# EAGLE design display (EAGLE 5.11)
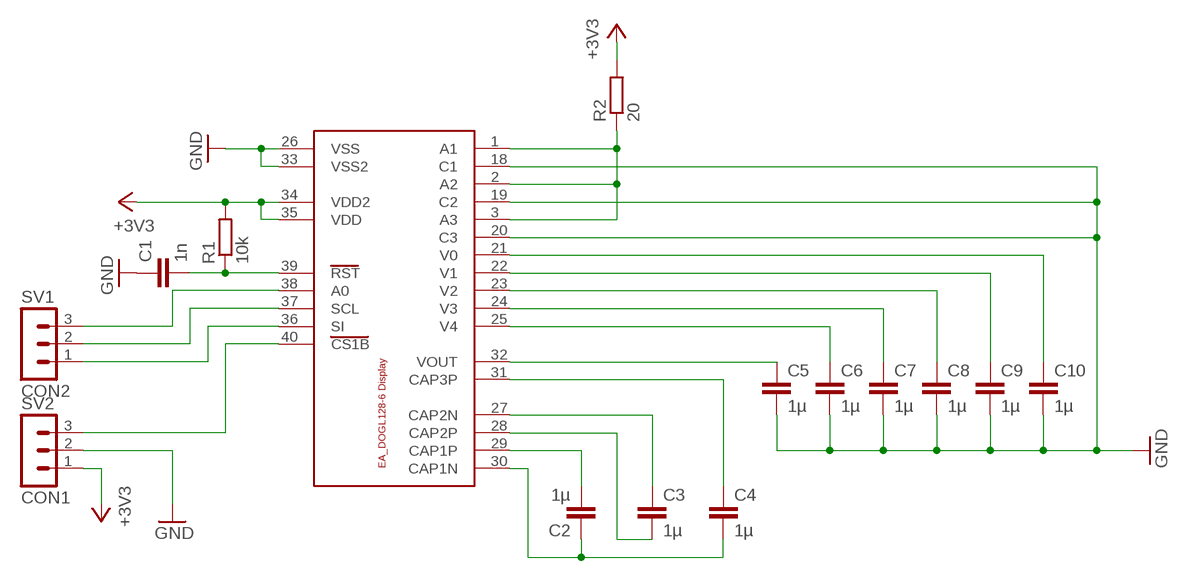
[diagram p0: schematic, sheet 1]

## Parts
C1  1n  C-EU025-025X050  [C025-025X050]
C2  1µ  C-EU025-025X050  [C025-025X050]
C3  1µ  C-EU025-025X050  [C025-025X050]
C4  1µ  C-EU025-025X050  [C025-025X050]
C5  1µ  C-EU025-025X050  [C025-025X050]
C6  1µ  C-EU025-025X050  [C025-025X050]
C7  1µ  C-EU025-025X050  [C025-025X050]
C8  1µ  C-EU025-025X050  [C025-025X050]
C9  1µ  C-EU025-025X050  [C025-025X050]
C10  1µ  C-EU025-025X050  [C025-025X050]
R1  10k  R-EU_0204/7  [0204/7]
R2  20  R-EU_0204/7  [0204/7]
SV1  CON2  MA03-1  [MA03-1]
SV2  CON1  MA03-1  [MA03-1]
U$1  DOGL128  EA_DOGL128-6  [EA_DOGL128-6]

## Nets
+3V3: R1.2 R2.2 SV2.1 U$1.34(VDD2) U$1.35(VDD)
GND: C1.1 C5.2 C6.2 C7.2 C8.2 C9.2 C10.2 SV2.2 U$1.18(C1) U$1.19(C2) U$1.20(C3) U$1.26(VSS) U$1.33(VSS2)
N$1: C1.2 R1.1 U$1.39(RST)
N$2: C3.2 U$1.28(CAP2P)
N$3: C3.1 U$1.27(CAP2N)
N$4: R2.1 U$1.1(A1) U$1.2(A2) U$1.3(A3)
N$5: C2.2 U$1.29(CAP1P)
N$6: C2.1 C4.2 U$1.30(CAP1N)
N$7: C4.1 U$1.31(CAP3P)
N$8: C5.1 U$1.32(VOUT)
N$9: C6.1 U$1.25(V4)
N$10: C7.1 U$1.24(V3)
N$11: C8.1 U$1.23(V2)
N$12: C9.1 U$1.22(V1)
N$13: C10.1 U$1.21(V0)
N$14: SV1.3 U$1.38(A0)
N$15: SV1.2 U$1.37(SCL)
N$16: SV1.1 U$1.36(SI)
N$17: SV2.3 U$1.40(CS1B)

## Library data of the parts
C1-C10 = rcl:C-EU: CAPACITOR, European symbol
R1 R2 = rcl:R-EU_: RESISTOR, European symbol
SV1 SV2 = con-lstb:MA03-1: PIN HEADER; OC_FARNELL: unknown; OC_NEWARK: unknown
U$1 = ea_dogl128:EA_DOGL128-6

## Board
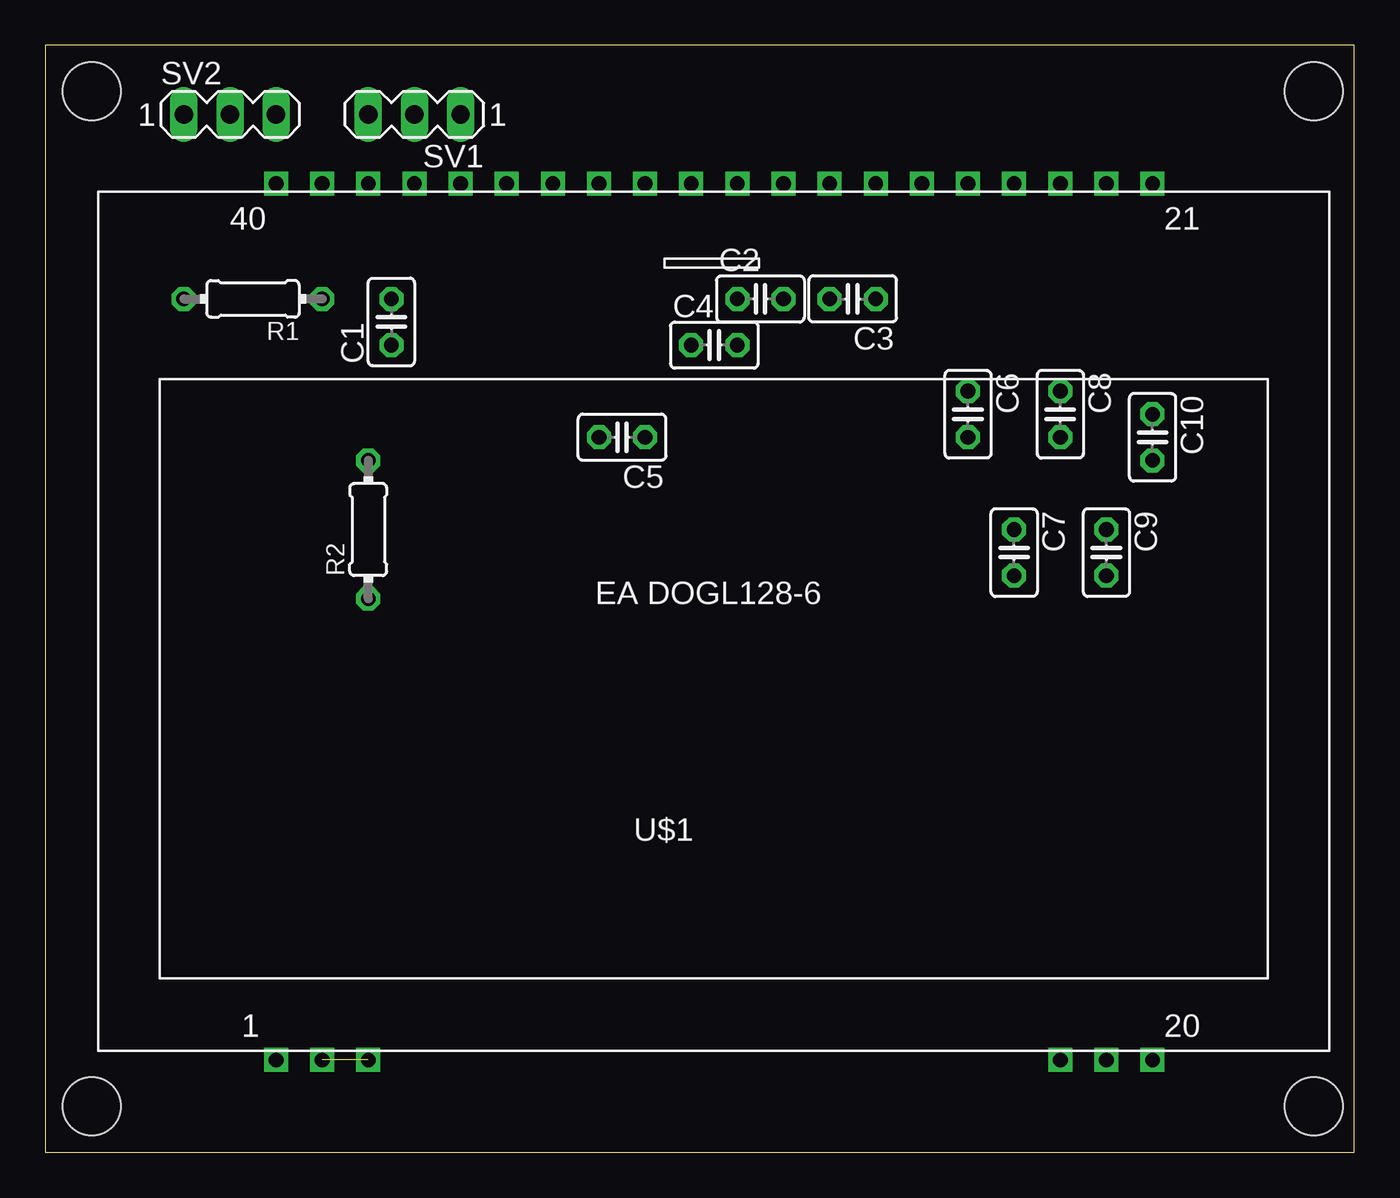
[diagram p1: board, top side]
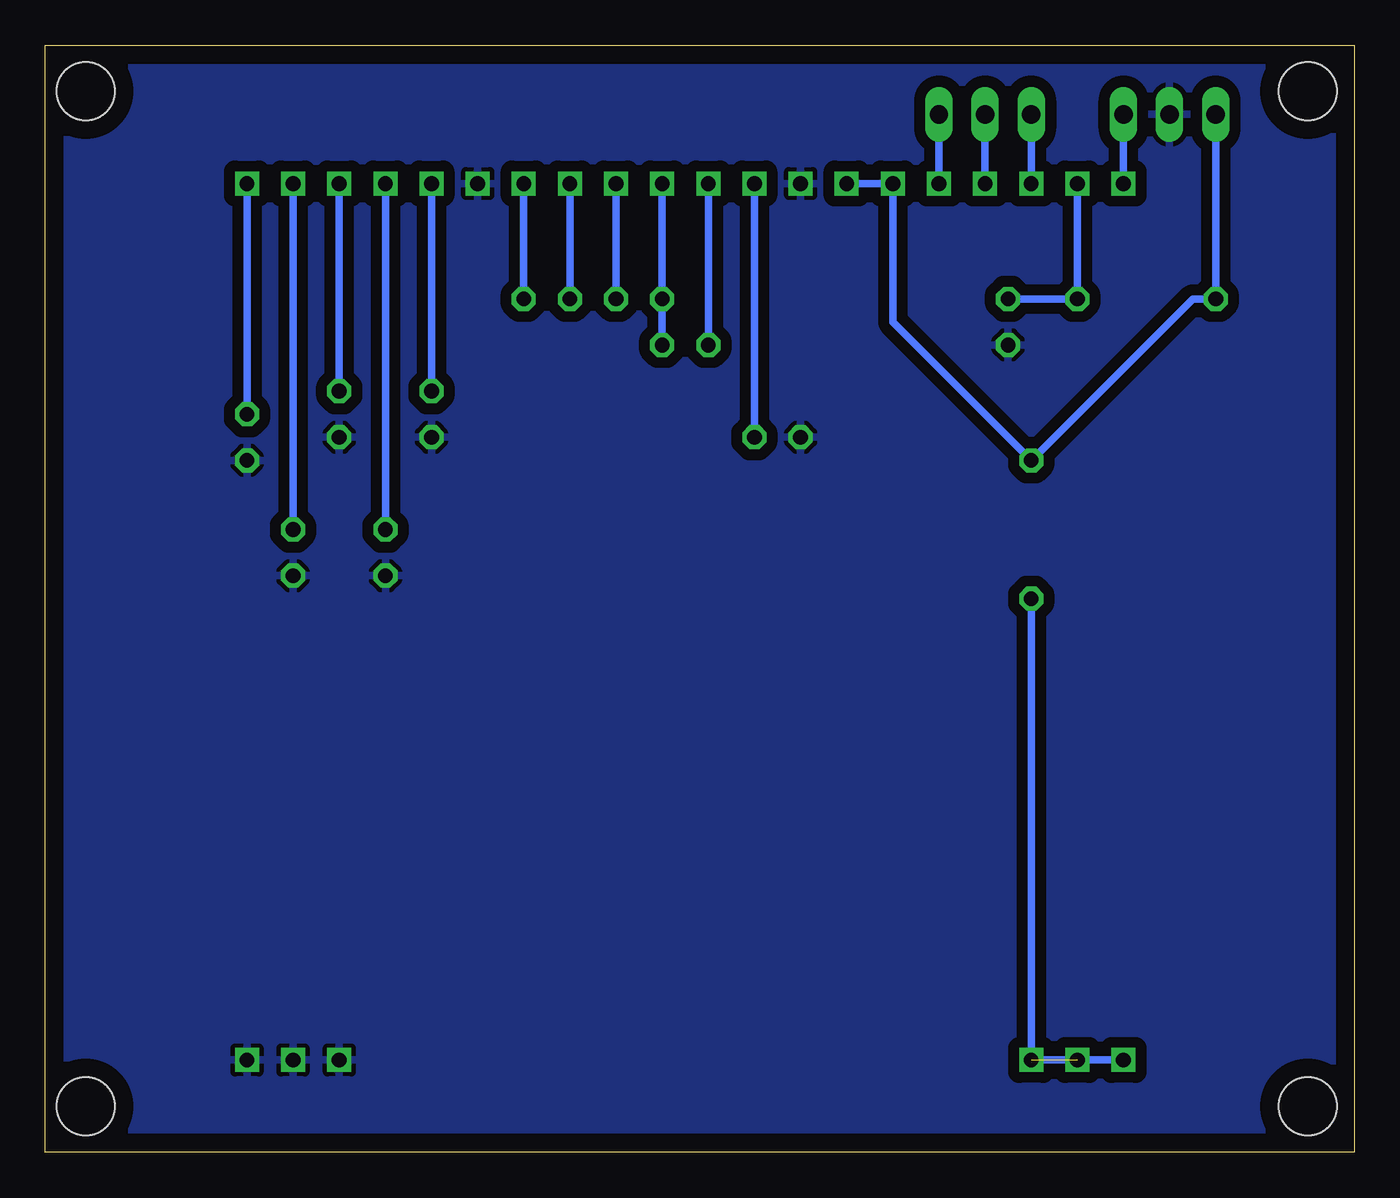
[diagram p2: board, bottom side, seen from below]

Size 72.06 x 60.95 mm. Coordinates in mm from the lower left corner, seen from the top.
Outline: 0,0 72.06,0 72.06,60.95 0,60.95 0,0
Copper layers (1*16): Top 0.035mm / dielectric 1.5mm / Bottom 0.035mm
Design rules "default": minimum track width 10mil, minimum drill 24mil, track to track 8mil, track to pad 8mil, pad to pad 8mil, via to via 8mil, smd to smd 8mil, copper to edge 40mil, drill to drill 8mil, minimum pad ring 10mil, minimum via ring 8mil, stop-mask expansion 4mil, vias tented up to drill 0mil, thermal gap 10mil
Holes 3.2 mm at 2.54,58.42 69.85,58.42 69.85,2.54 2.54,2.54

### Footprints (pad centres in the part's own frame; a part is rotated, then mirrored left to right if it is on the bottom)
C025-025X050 = drill 0.813 octagon: 1 -1.27,0; 2 1.27,0
0204/7 = drill 0.813 octagon: 1 -3.81,0; 2 3.81,0
MA03-1 = drill 1.016 long: 1 -2.54,0; 2 0,0; 3 2.54,0
EA_DOGL128-6 = drill 0.813 square: 1 0,0; 2 2.54,0; 3 5.08,0; 18 43.18,0; 19 45.72,0; 20 48.26,0; 21 48.26,48.26; 22 45.72,48.26; 23 43.18,48.26; 24 40.64,48.26; 25 38.1,48.26; 26 35.56,48.26; 27 33.02,48.26; 28 30.48,48.26; 29 27.94,48.26; 30 25.4,48.26; 31 22.86,48.26; 32 20.32,48.26; 33 17.78,48.26; 34 15.24,48.26; 35 12.7,48.26; 36 10.16,48.26; 37 7.62,48.26; 38 5.08,48.26; 39 2.54,48.26; 40 0,48.26

### Placement (x,y rotation side)
C1  19.05,45.72 90 top
C2  39.37,46.99 0 top
C3  44.45,46.99 180 top
C4  36.83,44.45 0 top
C5  31.75,39.37 180 top
C6  50.8,40.64 270 top
C7  53.34,33.02 270 top
C8  55.88,40.64 270 top
C9  58.42,33.02 270 top
C10  60.96,39.37 270 top
R1  11.43,46.99 180 top
R2  17.78,34.29 90 top
SV1  20.32,57.15 180 top
SV2  10.16,57.15 0 top
U$1  12.7,5.08 0 top

### Tracks (layer width: path | path; a pad name or v marks a point on that pad's centre or on a via)
+3V3
  Bottom 0.406: SV2.1 R1.2 8.89,46.99 R2.2 25.4,45.72 U$1.35 U$1.34
GND
  pour Bottom (isolate 0.61): 0,60.96 0,0 72.39,0 72.39,60.96
N$1
  Bottom 0.406: U$1.39 R1.1 C1.2
N$2
  Bottom 0.406: C3.2 U$1.28
N$3
  Bottom 0.406: C3.1 U$1.27
N$4  (1 unrouted)
  Bottom 0.406: R2.1 U$1.3 U$1.1
N$5
  Bottom 0.406: C2.2 U$1.29
N$6
  Bottom 0.406: U$1.30 C2.1 C4.2
N$7
  Bottom 0.406: C4.1 U$1.31
N$8
  Bottom 0.406: C5.1 U$1.32
N$9
  Bottom 0.406: C6.1 U$1.25
N$10
  Bottom 0.406: C7.1 U$1.24
N$11
  Bottom 0.406: C8.1 U$1.23
N$12
  Bottom 0.406: C9.1 U$1.22
N$13
  Bottom 0.406: C10.1 U$1.21
N$14
  Bottom 0.406: U$1.38 SV1.3
N$15
  Bottom 0.406: U$1.37 SV1.2
N$16
  Bottom 0.406: U$1.36 SV1.1
N$17
  Bottom 0.406: U$1.40 SV2.3